# Altium schematic sheet CONTROLLER.SchDoc
size A4; SheetNumber: 2; SheetTotal: 2
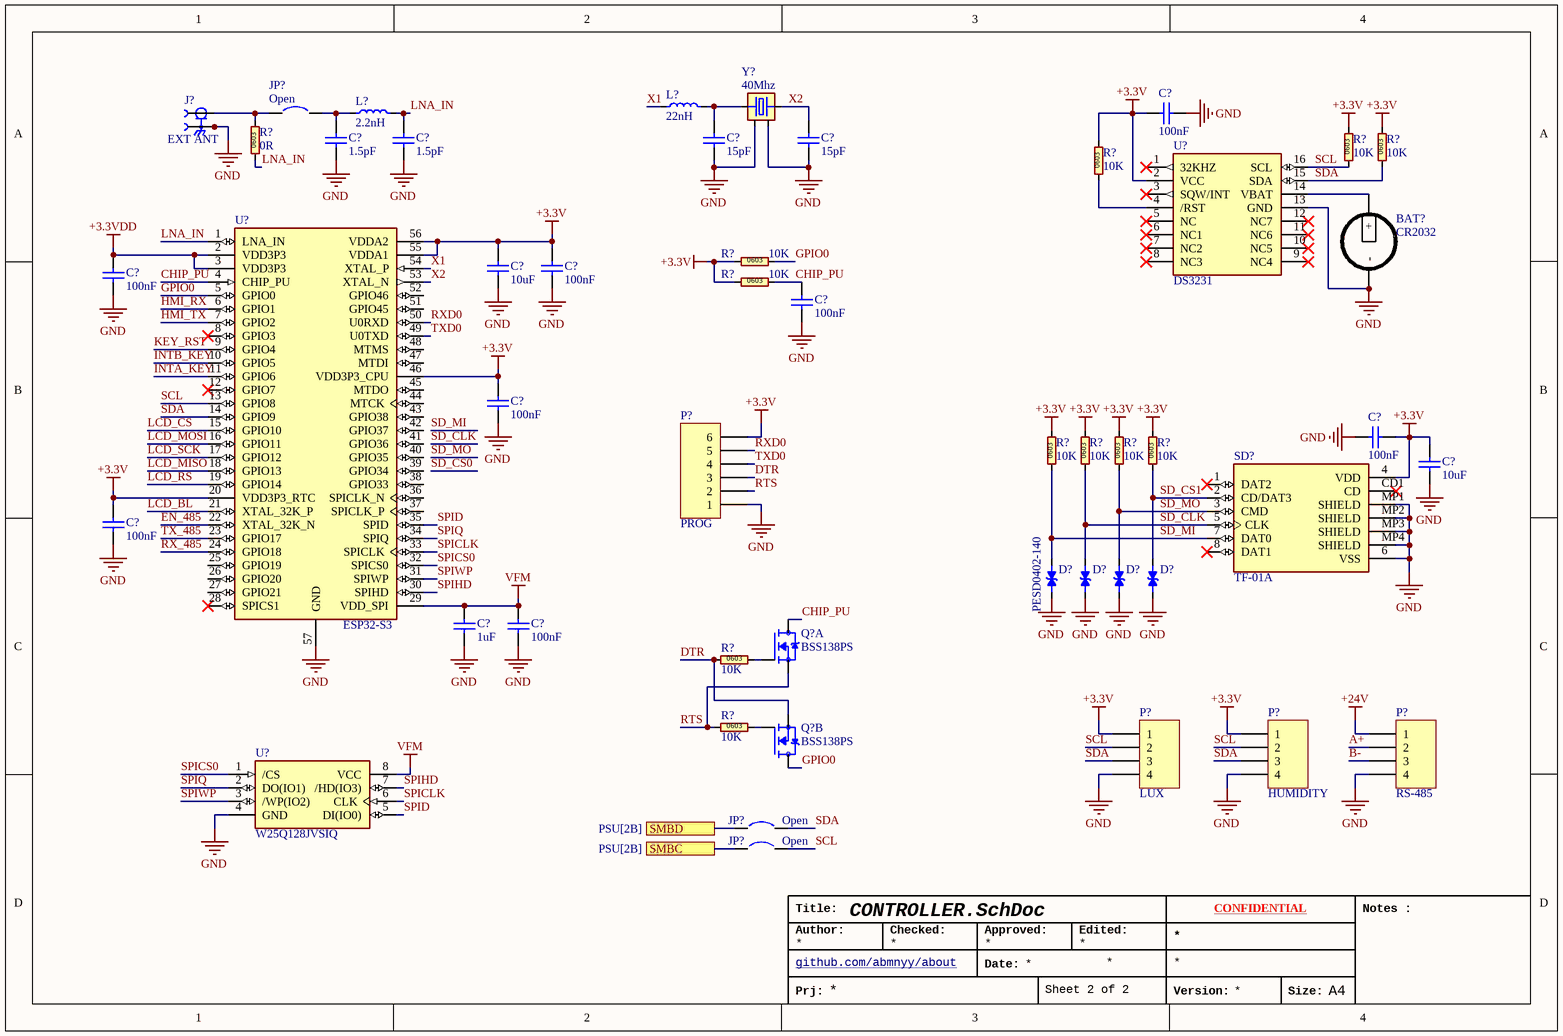
[diagram p0: CONTROLLER.SchDoc]

## Parts
(Parts that share a designator on the sheet are numbered #1, #2 ... from top to bottom, then left to right.)
BAT?  CR2032  [CR2032-BS-6-1]
C?#1  100nF  [C0603]
C?#2  1.5pF  [C0603]
C?#3  1.5pF  [C0603]
C?#4  15pF  [C0603]
C?#5  15pF  [C0603]
C?#6  10uF  [C0603]
C?#7  100nF  [C0603]
C?#8  100nF  [C0603]
C?#9  100nF  [C0603]
C?#10  100nF  [C0603]
C?#11  100nF  [C0603]
C?#12  10uF  [C0603]
C?#13  100nF  [C0603]
C?#14  1uF  [C0603]
C?#15  100nF  [C0603]
D?#1  PESD0402-140  [ESD0402]
D?#2  PESD0402-140  [ESD0402]  (value not drawn)
D?#3  PESD0402-140  [ESD0402]  (value not drawn)
D?#4  PESD0402-140  [ESD0402]  (value not drawn)
J?  EXT ANT  [IPEX_UF.L]
JP?#1  Open  [SB_STM]
JP?#2  Open  [SB_STM]
JP?#3  Open  [SB_STM]
L?#1  22nH  [L0603]
L?#2  2.2nH  [L0603]
P?#1  PROG  [HDR-6P-2.54mm]
P?#2  LUX  [JST_S4B-XH-A(LF)(SN)]
P?#3  HUMIDITY  [JST_S4B-XH-A(LF)(SN)]
P?#4  RS-485  [JST_S4B-XH-A(LF)(SN)]
Q?#1  BSS138PS  [SOT-363]  (part A of 2)
Q?#2  BSS138PS  [SOT-363]  (part B of 2)
R?#1  0R  [R0603]
R?#2  10K  [R0603]
R?#3  10K  [R0603]
R?#4  10K  [R0603]
R?#5  10K  [R0603]
R?#6  10K  [R0603]
R?#7  10K  [R0603]
R?#8  10K  [R0603]
R?#9  10K  [R0603]
R?#10  10K  [R0603]
R?#11  10K  [R0603]
R?#12  10K  [R0603]
SD?  TF-01A  [TF-01A]
U?#1  DS3231  [SOIC-16-WIDE]
U?#2  ESP32-S3  [ESP32-S3]
U?#3  W25Q128JVSIQ  [SOIC-8-208miL]
Y?  40Mhz  [OSC_SMD3225-4]

## Ports
SMBC (see PSU[2B]), SMBD (see PSU[2B])

## Nets
+3.3V: C?#1.2 C?#6.2 C?#7.2 C?#10.2 C?#11.1 C?#12.2 C?#13.2 P?#1.6 P?#2.1 P?#3.1 R?#2.2 R?#3.2 R?#4.2 R?#5.1 R?#6.1 R?#7.2 R?#8.2 R?#9.2 R?#10.2 SD?.4(VDD) U?#1.2(VCC) U?#2.20(VDD3P3_RTC) U?#2.46(VDD3P3_CPU) U?#2.55(VDDA1) U?#2.56(VDDA2)
+3.3VDD: C?#8.2 U?#2.2(VDD3P3) U?#2.3(VDD3P3)
+24V: P?#4.1
GND: BAT?.N(-) C?#1.1 C?#2.1 C?#3.1 C?#4.1 C?#5.1 C?#6.1 C?#7.1 C?#8.1 C?#9.2 C?#10.1 C?#11.2 C?#12.1 C?#13.1 C?#14.1 C?#15.1 D?#1.1 D?#2.1 D?#3.1 D?#4.1 J?.2(GROUND) J?.3(GROUND) P?#1.1 P?#2.4 P?#3.4 P?#4.4 SD?.6(VSS) SD?.MP1(SHIELD) SD?.MP2(SHIELD) SD?.MP3(SHIELD) SD?.MP4(SHIELD) U?#1.13(GND) U?#2.57(GND) U?#3.4(GND) Y?.2(GND) Y?.4(GND)
VFM: C?#14.2 C?#15.2 U?#2.29(VDD_SPI) U?#3.8(VCC)
A+: P?#4.2
B-: P?#4.3
CHIP_PU: C?#9.1 Q?#1.6(D1) R?#6.2 U?#2.4(CHIP_PU)
DTR: P?#1.3 Q?#2.4(S2) R?#11.1
EN_485: U?#2.22(XTAL_32K_N)
GPIO0: Q?#2.3(D2) R?#5.2 U?#2.5(GPIO0)
HMI_RX: U?#2.6(GPIO1)
HMI_TX: U?#2.7(GPIO2)
INTA_KEY: U?#2.11(GPIO6)
INTB_KEY: U?#2.10(GPIO5)
KEY_RST: U?#2.9(GPIO4)
LCD_BL: U?#2.21(XTAL_32K_P)
LCD_CS: U?#2.15(GPIO10)
LCD_MISO: U?#2.18(GPIO13)
LCD_MOSI: U?#2.16(GPIO11)
LCD_RS: U?#2.19(GPIO14)
LCD_SCK: U?#2.17(GPIO12)
LNA_IN: C?#3.2 L?#2.2 R?#1.1 U?#2.1(LNA_IN)
RTS: P?#1.2 Q?#1.1(S1) R?#12.1
RX_485: U?#2.24(GPIO18)
RXD0: P?#1.5 U?#2.50(U0RXD)
SCL: JP?#3.2 P?#2.2 P?#3.2 R?#2.1 U?#1.16(SCL) U?#2.13(GPIO8)
SD_CLK: D?#2.2 R?#8.1 SD?.5(CLK)
SD_CS1: D?#4.2 R?#10.1 SD?.2(CD/DAT3)
SD_MI: D?#1.2 R?#7.1 SD?.7(DAT0)
SD_MO: D?#3.2 R?#9.1 SD?.3(CMD)
SDA: JP?#2.2 P?#2.3 P?#3.3 R?#3.1 U?#1.15(SDA) U?#2.14(GPIO9)
SMBC: JP?#3.1 ; port SMBC
SMBD: JP?#2.1 ; port SMBD
SPICLK: U?#2.33(SPICLK) U?#3.6(CLK)
SPICS0: U?#2.32(SPICS0) U?#3.1(/CS)
SPID: U?#2.35(SPID) U?#3.5(DI(IO0))
SPIHD: U?#2.30(SPIHD) U?#3.7(/HD(IO3))
SPIQ: U?#2.34(SPIQ) U?#3.2(DO(IO1))
SPIWP: U?#2.31(SPIWP) U?#3.3(/WP(IO2))
TX_485: U?#2.23(GPIO17)
TXD0: P?#1.4 U?#2.49(U0TXD)
X1: L?#1.1 U?#2.54(XTAL_P)
X2: C?#5.2 U?#2.53(XTAL_N) Y?.3(OSC2)
NetBAT?_P: BAT?.P(+) U?#1.14(VBAT)
NetC?#2_2: C?#2.2 JP?#1.2 L?#2.1
NetC?#4_2: C?#4.2 L?#1.2 Y?.1(OSC1)
NetJ?_1: J?.1(SIGNAL) JP?#1.1 R?#1.2
NetQ?#1_2: Q?#1.2(G1) R?#11.2
NetQ?#2_5: Q?#2.5(G2) R?#12.2
NetR?#4_1: R?#4.1 U?#1.4(/RST)

Not connected (* = marked no-connect by the designer): SD? 1(DAT2)* 8(DAT1)* CD1(CD)*; U?#1 1(32KHZ)* 3(SQW/INT)* 5(NC)* 6(NC1)* 7(NC2)* 8(NC3)* 9(NC4)* 10(NC5)* 11(NC6)* 12(NC7)*; U?#2 8(GPIO3)* 12(GPIO7)* 25(GPIO19) 26(GPIO20) 27(GPIO21) 28(SPICS1)* 36(SPICLK_N) 37(SPICLK_P) 38(GPIO33) 39(GPIO34) 40(GPIO35) 41(GPIO36) 42(GPIO37) 43(GPIO38) 44(MTCK) 45(MTDO) 47(MTDI) 48(MTMS) 51(GPIO45) 52(GPIO46)

## Notes on the sheet
- Title:
- Author:
- Checked:
- Approved:
- Edited:
- CONFIDENTIAL
- Notes :
- Prj:
- github.com/abmnyy/about <https://github.com/abmnyy/about>
- Date:
- Version:
- Size:
- A4
- (in symbol Resistor 0603 (Inch)) 0603

## Library data of the parts
BAT? = CR2032-BS-6-1: Battery base CR2032 SMD Battery Connectors; MFR.Part #: *; LCSC Part #: *; ComponentLink1Description: Datasheet; ComponentLink1URL: *
C?#1-C?#3 C?#6-C?#15 = Capacitor 0603 (Inch): 0603 SMD Non-Polarity Capacitor; MFR.Part #: *; LCSC Part #: *; ComponentLink1Description: Datasheet; ComponentLink1URL: *
C?#4 C?#5 = Capacitor 0603 (Inch): 0603 SMD Non-Polarity Capacitor; MFR.Part #: X322540MPB4SI; LCSC Part #: C9010; ComponentLink1Description: Datasheet
  C?#4: ComponentLink1URL: https://www.lcsc.com/datasheet/C9010.pdf
  C?#5: ComponentLink1URL: *
D?#1-D?#4 = PESD0402-140: 40V Bidirectional 14V 0402 ESD and Surge Protection (TVS/ESD) ROHS; MF: Littelfuse; MP: SMAJ6.5CA; Purchase-URL: https://pricing.snapeda.com/search/part/SMAJ6.5CA/?ref=eda; SnapEDA_Link: https://www.snapeda.com/parts/SMAJ6.5CA/Littelfuse/view-part/?ref=snap; Value: *; Package: DO-214 Littelfuse; Check_prices: https://www.snapeda.com/parts/SMAJ6.5CA/Littelfuse/view-part/?ref=eda; Price: None; Availability: In Stock; LCSC Part #: C83330; JLCPCB Part: C10662
J? = IPEX UF.L: 1 POS Vertical SMD Small form factor with big performance through 6 GHz connector,MHF, RF, micro-coaxial MHF I Receptacle; MFR.Part #: *; LCSC Part #: *; ComponentLink1Description: Datasheet; ComponentLink1URL: *
JP?#1-JP?#3 = Jumper Solder: Jumper Solder Pad; Published: 24-Mar-1999; Revision: July-2002: Re-released for DXP Platform.; Publisher: Altium Limited
L?#1 = INDUCTOR 0603: Inductor with Package: 0603 Inch; MFR.Part #: VHF160808H22NJT; LCSC Part #: C90207; ComponentLink1Description: Datasheet; ComponentLink1URL: https://www.lcsc.com/datasheet/C90207.pdf
L?#2 = INDUCTOR 0603: Inductor with Package: 0603 Inch; MFR.Part #: *; LCSC Part #: *; ComponentLink1Description: Datasheet; ComponentLink1URL: *
P?#1 = Header 6: Header, 6-Pin; LatestRevisionDate: 17-Jul-2002; LatestRevisionNote: Re-released for DXP Platform.; Publisher: Altium Limited
P?#2-P?#4 = Connector 4P: CONNECTOR HEADER; LatestRevisionDate: 17-Jul-2002; LatestRevisionNote: Re-released for DXP Platform.; Publisher: Altium Limited
Q?#1 Q?#2 = BSS138PS: 60 V, 320 mA dual N-channel Trench MOSFET; MFR.Part #: BSS138PS,115; LCSC Part #: C193381; ComponentLink1Description: Datasheet; ComponentLink1URL: https://www.lcsc.com/datasheet/lcsc_datasheet_2410121736_Nexperia-BSS138PS-115_C193381.pdf
R?#1-R?#12 = Resistor 0603 (Inch): 0603 SMD Thick Resistor; MFR.Part #: *; LCSC Part #: *; ComponentLink1Description: Datasheet; ComponentLink1URL: *
SD? = TF-01A: Standard Card Edge Connectors; MF: HRO Electronics Co., Ltd.; Price: None; Availability: Not in stock; MP: TF-01A; Package: Package; SnapEDA_Link: https://www.snapeda.com/parts/TF-01A/HRO+Electronics+Co.%252C+Ltd./view-part/?ref=snap; Check_prices: https://www.snapeda.com/parts/TF-01A/HRO+Electronics+Co.%252C+Ltd./view-part/?ref=eda; Value: *; LCSC Part #: C2889258
U?#1 = DS3231: Real Time Clock (RTC) IC Clock/Calendar - IÂ²C, 2-Wire Serial 8-SOIC (0.154, 3.90mm Width); MFR.Part #: DS3231SN#T&R; LCSC Part #: C9866; ComponentLink1Description: Datasheet; ComponentLink1URL: https://www.lcsc.com/datasheet/C9866.pdf
U?#2 = ESP32-S3: IC RF TxRx + MCU Bluetooth, WiFi 802.11b/g/n, Bluetooth v5.0 2.412GHz ~ 2.484GHz 56-VFQFN Exposed Pad; MFR.Part #: *; LCSC Part #: *; ComponentLink1Description: Datasheet; ComponentLink1URL: *
U?#3 = W25Q128JVSIQ: FLASH - NOR Memory IC 128Mb (16M x 8) SPI - Quad I/O, QPI, DTR 133 MHz 8-SOIC; MFR.Part #: *; LCSC Part #: *; ComponentLink1Description: Datasheet; ComponentLink1URL: *
Y? = XTAL-40Mhz: 40MHz Crystal Oscillator 15pF ±10ppm ±20ppm SMD3225-4P Crystals ROHS; MFR.Part #: X322540MPB4SI; LCSC Part #: C9010; ComponentLink1Description: Datasheet; ComponentLink1URL: https://www.lcsc.com/datasheet/C9010.pdf